# Altium schematic sheet Reefing-Thermocouple.SchDoc: Reefing System
size A4; DocumentNumber: Subtitle; Revision: V1.0; SheetNumber: 10; SheetTotal: 13; Author: Luca Jost; Subtitle: Thermocouple
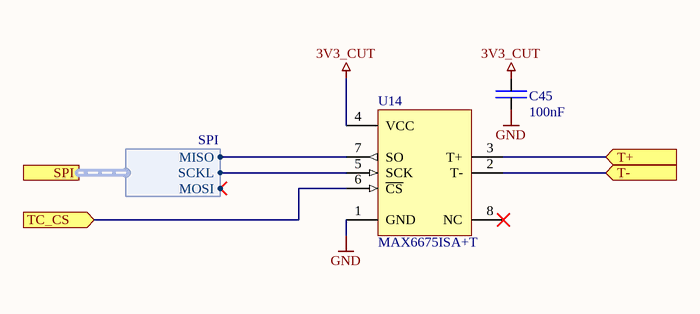
[diagram p0: Reefing-Thermocouple.SchDoc]

## Parts
C45  100nF  [SMD Keramikkondensator 0402]
U14  MAX6675ISA+T  [SMD IC SOIC-8]

## Ports
SPI (harness SPI), T+ (in), T- (in), TC_CS (in)

## Harnesses
SPI: SCKL, MOSI, MISO

## Nets
3V3_CUT: C45.2 U14.4(VCC)
GND: C45.1 U14.1(GND)
T+: U14.3(T+) ; port T+
T-: U14.2(T-) ; port T-
TC_CS: U14.6(~{CS}) ; port TC_CS
NetU14_5: U14.5(SCK) ; port SPI.SCKL
NetU14_7: U14.7(SO) ; port SPI.MISO

Not connected (* = marked no-connect by the designer): U14 8(NC)*

## Notes on the sheet
- Title
- Author:
- Subtitle
- Date:
- Rev:
- File:
- Sheet
- of

## Library data of the parts
C45 = E6 - 100nF: SMD Ceramic Capacitor E6; Unit Price: 0.01; JLC: C307331
U14 = MAX6675ISA+T: Cold-Junction-Compensated K-Thermocoupleto-Digital Converter; ComponentLink1Description: Datasheet; ComponentLink1URL: https://datasheet.lcsc.com/lcsc/1810181421_Maxim-Integrated-MAX6675ISA-T_C16030.pdf; JLC: C16030; Unit Price: 2.95